# Altium schematic sheet Main.SchDoc
size A4; SheetNumber: 1; SheetTotal: 3
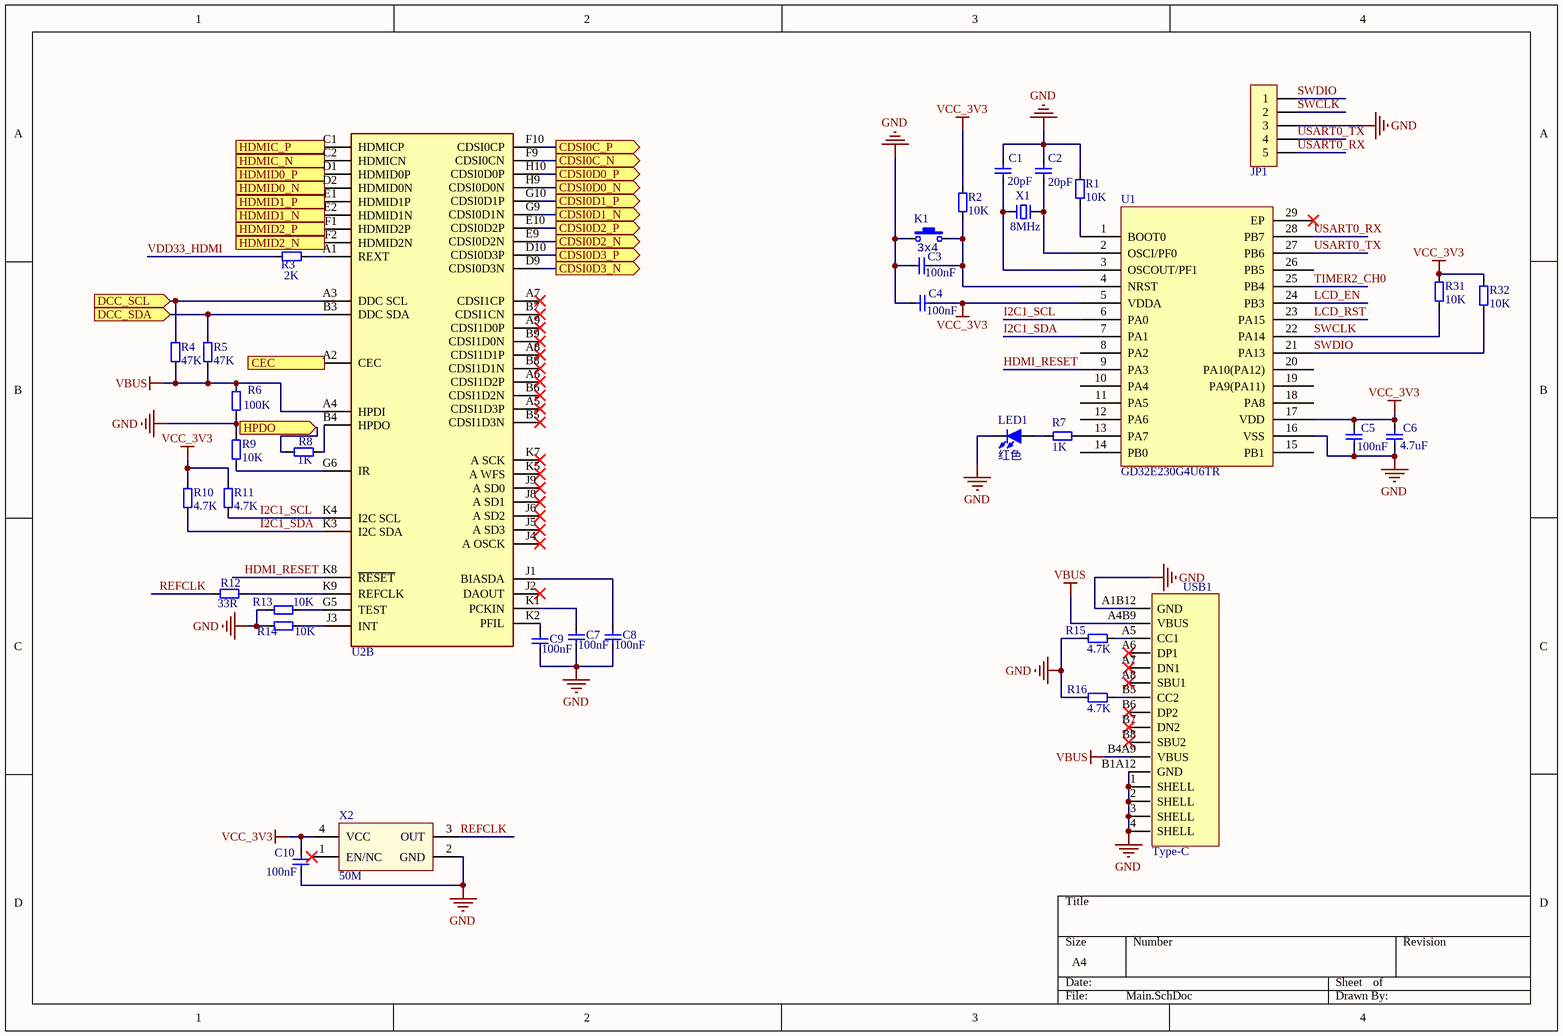
[diagram p0: Main.SchDoc]

## Parts
C1  20pF  [C0402_L]
C2  20pF  [C0402_L]
C3  100nF  [C0402_L]
C4  100nF  [C0402_L]
C5  100nF  [C0402_L]
C6  4.7uF  [C0402_L]
C7  100nF  [C0402_L]
C8  100nF  [C0402_L]
C9  100nF  [C0402_L]
C10  100nF  [C0402_L]
JP1  HDR-1X5  [Test-2.54-5P]  (value not drawn)
K1  value 3x4  [ButtonTACT_3x4x2_180H]
LED1  红色  [LED0402]
R1  10K  [R0402_L]
R2  10K  [R0402_L]
R3  2K  [R0402_L]
R4  47K  [R0402_L]
R5  47K  [R0402_L]
R6  100K  [R0402_L]
R7  1K  [R0402_L]
R8  1K  [R0402_L]
R9  10K  [R0402_L]
R10  4.7K  [R0402_L]
R11  4.7K  [R0402_L]
R12  33R  [R0402_L]
R13  10K  [R0402_L]
R14  10K  [R0402_L]
R15  4.7K  [R0402_L]
R16  4.7K  [R0402_L]
R31  10K  [R0402_L]
R32  10K  [R0402_L]
U1  GD32E230G4U6TR  [GD32E230G4U6TR]
U2  TC358870XBG  [TC358870XBG]  (value not drawn)  (part B of 2)
USB1  Type-C  [Type-C 16P]
X1  8MHz  [OSC 5032-8M]
X2  50M  [OSC 3225-4P]

## Ports
CDSI0C_N (out), CDSI0C_P (out), CDSI0D0_N (out), CDSI0D0_P (out), CDSI0D1_N (out), CDSI0D1_P (out), CDSI0D2_N (out), CDSI0D2_P (out), CDSI0D3_N (out), CDSI0D3_P (out), CEC (in), DCC_SCL (in), DCC_SDA (in), HDMIC_N (in), HDMIC_P (in), HDMID0_N (in), HDMID0_P (in), HDMID1_N (in), HDMID1_P (in), HDMID2_N (in), HDMID2_P (in), HPDO (in)

## Nets
GND: C1.2 C2.2 C3.2 C4.2 C5.2 C6.2 C7.2 C8.1 C9.1 C10.1 JP1.3 K1.1 LED1.2(K) R1.1 R6.2 R9.2 R13.2 R14.2 R15.2 R16.2 U1.16(VSS) USB1.1(SHELL) USB1.2(SHELL) USB1.3(SHELL) USB1.4(SHELL) USB1.A1B12(GND) USB1.B1A12(GND) X2.2(GND)
VBUS: R4.1 R5.1 R6.1 U2.A4(HPDI) USB1.A4B9(VBUS) USB1.B4A9(VBUS)
VCC_3V3: C4.1 C5.1 C6.1 C10.2 R2.1 R10.1 R11.1 R31.1 R32.1 U1.5(VDDA) U1.17(VDD) X2.4(VCC)
CDSI0C_N: U2.F9(CDSI0CN) ; port CDSI0C_N
CDSI0C_P: U2.F10(CDSI0CP) ; port CDSI0C_P
CDSI0D0_N: U2.H9(CDSI0D0N) ; port CDSI0D0_N
CDSI0D0_P: U2.H10(CDSI0D0P) ; port CDSI0D0_P
CDSI0D1_N: U2.G9(CDSI0D1N) ; port CDSI0D1_N
CDSI0D1_P: U2.G10(CDSI0D1P) ; port CDSI0D1_P
CDSI0D2_N: U2.E9(CDSI0D2N) ; port CDSI0D2_N
CDSI0D2_P: U2.E10(CDSI0D2P) ; port CDSI0D2_P
CDSI0D3_N: U2.D9(CDSI0D3N) ; port CDSI0D3_N
CDSI0D3_P: U2.D10(CDSI0D3P) ; port CDSI0D3_P
CEC: U2.A2(CEC) ; port CEC
DCC_SCL: R4.2 U2.A3(DDC_SCL) ; port DCC_SCL
DCC_SDA: R5.2 U2.B3(DDC_SDA) ; port DCC_SDA
HDMI_RESET: U1.9(PA3) U2.K8(~{RESET})
HDMIC_N: U2.C2(HDMICN) ; port HDMIC_N
HDMIC_P: U2.C1(HDMICP) ; port HDMIC_P
HDMID0_N: U2.D2(HDMID0N) ; port HDMID0_N
HDMID0_P: U2.D1(HDMID0P) ; port HDMID0_P
HDMID1_N: U2.E2(HDMID1N) ; port HDMID1_N
HDMID1_P: U2.E1(HDMID1P) ; port HDMID1_P
HDMID2_N: U2.F2(HDMID2N) ; port HDMID2_N
HDMID2_P: U2.F1(HDMID2P) ; port HDMID2_P
HPDO: R8.2 ; port HPDO
I2C1_SCL: R11.2 U1.6(PA0) U2.K4(I2C_SCL)
I2C1_SDA: R10.2 U1.7(PA1) U2.K3(I2C_SDA)
LCD_EN: U1.24(PB3)
LCD_RST: U1.23(PA15)
REFCLK: R12.2 X2.3(OUT)
SWCLK: JP1.2 R31.2 U1.22(PA14)
SWDIO: JP1.1 R32.2 U1.21(PA13)
TIMER2_CH0: U1.25(PB4)
USART0_RX: JP1.5 U1.28(PB7)
USART0_TX: JP1.4 U1.27(PB6)
VDD33_HDMI: R3.2
NetC1_1: C1.1 U1.3(OSCOUT/PF1) X1.1
NetC2_1: C2.1 U1.2(OSCI/PF0) X1.2
NetC3_1: C3.1 K1.2 R2.2 U1.4(NRST)
NetC7_1: C7.1 U2.K1(PCKIN)
NetC8_2: C8.2 U2.J1(BIASDA)
NetC9_2: C9.2 U2.K2(PFIL)
NetLED1_1: LED1.1(A) R7.1
NetR1_2: R1.2 U1.1(BOOT0)
NetR3_1: R3.1 U2.A1(REXT)
NetR7_2: R7.2 U1.13(PA7)
NetR8_1: R8.1 U2.B4(HPDO)
NetR9_1: R9.1 U2.G6(IR)
NetR12_1: R12.1 U2.K9(REFCLK)
NetR13_1: R13.1 U2.G5(TEST)
NetR14_1: R14.1 U2.J3(INT)
NetR15_1: R15.1 USB1.A5(CC1)
NetR16_1: R16.1 USB1.B5(CC2)

Not connected (* = marked no-connect by the designer): U1 8(PA2) 10(PA4) 11(PA5) 12(PA6) 14(PB0) 15(PB1) 18(PA8) 19(PA9(PA11)) 20(PA10(PA12)) 26(PB5) 29(EP)*; U2 A5(CDSI1D3P)* A6(CDSI1D2P)* A7(CDSI1CP)* A8(CDSI1D1P)* A9(CDSI1D0P)* B5(CDSI1D3N)* B6(CDSI1D2N)* B7(CDSI1CN)* B8(CDSI1D1N)* B9(CDSI1D0N)* J2(DAOUT)* J4(A_OSCK)* J5(A_SD3)* J6(A_SD2)* J8(A_SD1)* J9(A_SD0)* K5(A_WFS)* K7(A_SCK)*; USB1 A6(DP1)* A7(DN1)* A8(SBU1)* B6(DP2)* B7(DN2)* B8(SBU2)*; X2 1(EN/NC)*

## Library data of the parts
C1-C10 = C: 贴片电容; BOM名称: 无极性贴片电容; 联系卖家，免费查找封装: 唯一出售店铺网址https://shop463601444.taobao.com
JP1 = Header 5: 5P接插件; 版权归属: 源创客; BOM名称: 5P接插件; 学习资源: www.ooocke.com
K1 = ButtonTACT_3x4x2_180: Button
LED1 = LED-SMD: 贴片LED; 封装库来自淘宝卖家 ID：黄晶宝石: 其他店铺购入均为假冒，请立即申请退款，本店奖励现金5~20元; BOM名称: 贴片LED
R1-R16 R31 R32 = R: 贴片电阻; 联系卖家，免费查找封装: 唯一出售店铺网址https://shop463601444.taobao.com; 封装库来自淘宝卖家ID：黄晶宝石: 其他店铺购入均为盗版假冒封装库，请立即申请退款; BOM名称: 贴片电阻
X1 = XTAL-2P: 2脚无源脚晶振; 联系卖家，免费查找封装: 唯一出售店铺网址https://shop463601444.taobao.com; BOM名称: 2脚无源脚晶振
X2 = XTAL-ACT-4P: 4脚有源晶振; 联系卖家，免费查找封装: 唯一出售店铺网址https://shop463601444.taobao.com; BOM名称: 4脚有源晶振